# EAGLE design DIYpiano (EAGLE 9.2.2)
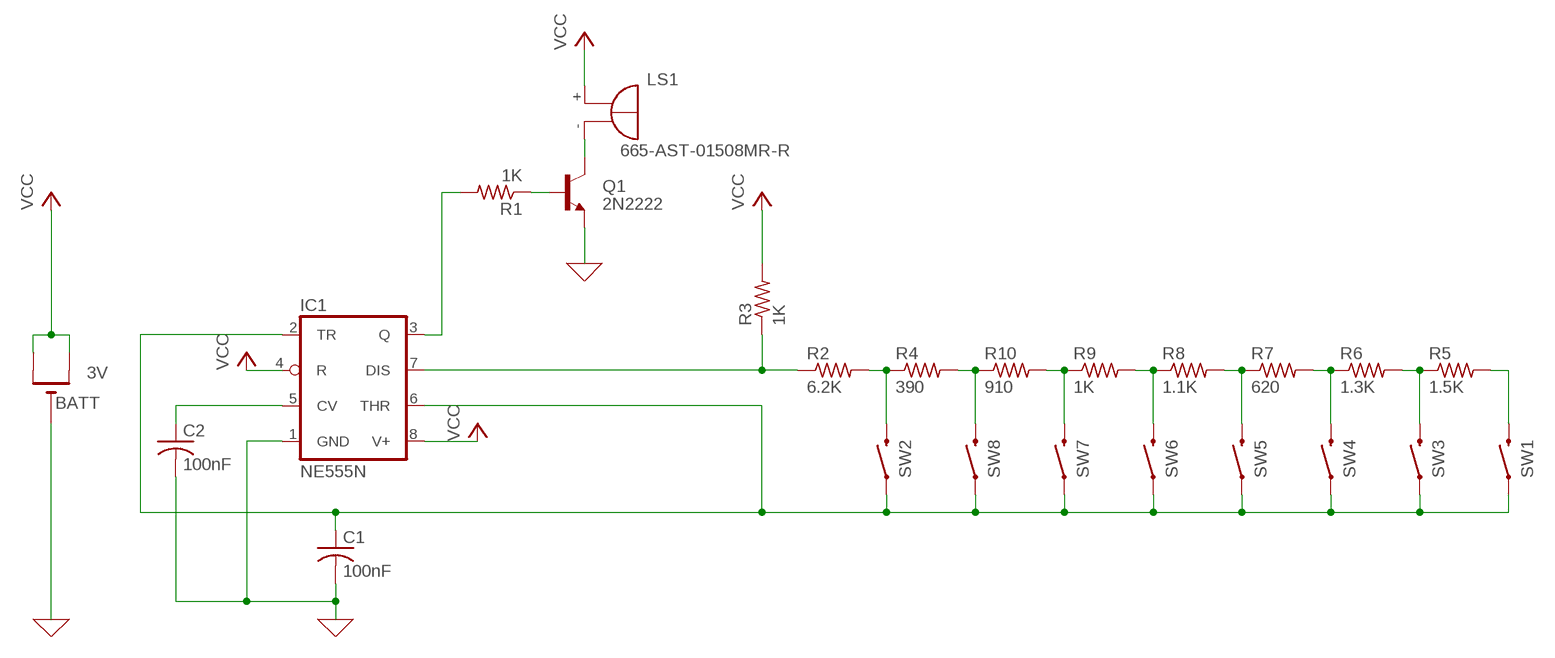
[diagram p0: schematic, sheet 1]

## Parts
BATT  3V  CR1220THM  [CR1220-THM]
C1  100nF  C-US025-025X050  [C025-025X050]
C2  100nF  C-US025-025X050  [C025-025X050]
IC1  NE555N  [DIL08]
LS1  F/HMB  [F/HMB]
Q1  2N2222  -NPN-TO92-E1  [TO92-E1]
R1  1K  R-US_0207/10  [0207/10]
R2  6.2K  R-US_0207/10  [0207/10]
R3  1K  R-US_0207/10  [0207/10]
R4  390  R-US_0207/10  [0207/10]
R5  1.5K  R-US_0207/10  [0207/10]
R6  1.3K  R-US_0207/10  [0207/10]
R7  620  R-US_0207/10  [0207/10]
R8  1.1K  R-US_0207/10  [0207/10]
R9  1K  R-US_0207/10  [0207/10]
R10  910  R-US_0207/10  [0207/10]
SW1  MOMENTARY-SWITCH-SPST-PTH-6.0MM  [TACTILE_SWITCH_PTH_6.0MM]
SW2  MOMENTARY-SWITCH-SPST-PTH-6.0MM  [TACTILE_SWITCH_PTH_6.0MM]
SW3  MOMENTARY-SWITCH-SPST-PTH-6.0MM  [TACTILE_SWITCH_PTH_6.0MM]
SW4  MOMENTARY-SWITCH-SPST-PTH-6.0MM  [TACTILE_SWITCH_PTH_6.0MM]
SW5  MOMENTARY-SWITCH-SPST-PTH-6.0MM  [TACTILE_SWITCH_PTH_6.0MM]
SW6  MOMENTARY-SWITCH-SPST-PTH-6.0MM  [TACTILE_SWITCH_PTH_6.0MM]
SW7  MOMENTARY-SWITCH-SPST-PTH-6.0MM  [TACTILE_SWITCH_PTH_6.0MM]
SW8  MOMENTARY-SWITCH-SPST-PTH-6.0MM  [TACTILE_SWITCH_PTH_6.0MM]

## Nets
GND: BATT.- C1.2 C2.2 IC1.1(GND) Q1.3(E)
N$1: R2.2 R4.1 SW2.3
N$2: IC1.7(DIS) R2.1 R3.1
N$3: C1.1 IC1.2(TR) IC1.6(THR) SW1.1 SW2.1 SW3.1 SW4.1 SW5.1 SW6.1 SW7.1 SW8.1
N$4: R4.2 R10.1 SW8.3
N$5: R9.1 R10.2 SW7.3
N$6: R8.1 R9.2 SW6.3
N$7: R7.1 R8.2 SW5.3
N$8: R6.1 R7.2 SW4.3
N$9: R5.1 R6.2 SW3.3
N$10: R5.2 SW1.3
N$11: IC1.3(Q) R1.2
N$12: C2.1 IC1.5(CV)
N$13: LS1.- Q1.1(C)
N$14: Q1.2(B) R1.1
VCC: BATT.+1(+) BATT.+2(+1) IC1.4(R) IC1.8(V+) LS1.+ R3.2

## Library data of the parts
BATT = adafruit:CR1220: CR1216/CR1220/CR1225 12mm 3V lithium coin cell Great for battery packup. Both SMT and THM holders. Note the THM package has the ground pads on both sides of the PCB so that the masks are the same - this reduces the cost; MF: KEYSTONE ELECTR; MOUSER#: 534-3001; MPN: 3001; OC_NEWARK: 66F5623
C1 C2 = rcl:C-US: CAPACITOR, American symbol; MOUSER#: 581-SR201C104KARTR1; OC_NEWARK: unknown; SPICEPREFIX: C
IC1 = linear:*555: TIMER; MOUSER#: 595-TLC555CP; MPN: TLC555CP; OC_NEWARK: 24M8296
LS1 = buzzer:F/HMB: BUZZER Source: Buerklin; MOUSER#: 665-AST-01508MR-R; OC_FARNELL: unknown; OC_NEWARK: unknown
Q1 = transistor:*-NPN-: NPN Transistror BF959 corrected 2008.03.06; MF: FAIRCHILD SEMICONDUCTOR; MOUSER#: 833-PN2222A-AP; MPN: PN2222ATF; OC_NEWARK: 58K2048
R1 R3 R9 = rcl:R-US_: RESISTOR, American symbol; MOUSER#: 660-MF1/4DCT26A1001F; OC_NEWARK: unknown; SPICEPREFIX: R
R2 = rcl:R-US_: RESISTOR, American symbol; MOUSER#: 603-MFR-25FRF52-6K2; OC_NEWARK: unknown; SPICEPREFIX: R
R4 = rcl:R-US_: RESISTOR, American symbol; MOUSER#: 603-MFR-25FTE52-390R; OC_NEWARK: unknown; SPICEPREFIX: R
R5 = rcl:R-US_: RESISTOR, American symbol; MOUSER#: 603-MFR-25FBF52-1K5; OC_NEWARK: unknown; SPICEPREFIX: R
R6 = rcl:R-US_: RESISTOR, American symbol; MOUSER#: 603-MFR-25FBF52-1K3; OC_NEWARK: unknown; SPICEPREFIX: R
R7 = rcl:R-US_: RESISTOR, American symbol; MOUSER#: 603-MFR-25FBF52-620R; OC_NEWARK: unknown; SPICEPREFIX: R
R8 = rcl:R-US_: RESISTOR, American symbol; MOUSER#: 603-MFR-25FBF52-1K1; OC_NEWARK: unknown; SPICEPREFIX: R
R10 = rcl:R-US_: RESISTOR, American symbol; MOUSER#: 603-MFR-25FRF52-910R; OC_NEWARK: unknown; SPICEPREFIX: R
SW1-SW8 = SparkFun-Switches:MOMENTARY-SWITCH-SPST: Momentary Switch (Pushbutton) - SPST Normally-open (NO) SPST momentary switches (buttons, pushbuttons). Variants PTH-12MM - 12mm square, through-hole Momentary Pushbutton Switch - 12mm Square <https://www.sparkfun.com/products/9190> (COM-09190) PTH-6.0MM, PTH-6.0MM-KIT - 6.0mm square, through-hole Mini Pushbutton Switch <https://www.sparkfun.com/products/97> (COM-00097) KIT package intended for soldering kit's - only one side of pads' copper is exposed. PTH-RIGHT-ANGLE-KIT - Right-angle, through-hole Right Angle Tactile Button <https://www.sparkfun.com/products/10791> - Used on SparkFun BigTime Watch Kit <https://www.sparkfun.com/products/11734> SMD-12MM - 12mm square, surface-mount Tactile Button - SMD (12mm) <https://www.sparkfun.com/products/12993> (COM-12993) Used on SparkFun PicoBoard <https://www.sparkfun.com/products/11888> SMD-4.5MM - 4.5mm Square Trackball Switch Used on SparkFun Blackberry Trackballer Breakout <https://www.sparkfun.com/products/13169> SMD-4.6MMX2.8MM - 4.60mm x 2.80mm, surface mount Used on SparkFun SAMD21 Mini Breakout <https://www.sparkfun.com/products/13664> SMD-5.2MM, SMD-5.2-REDUNDANT - 5.2mm square, surface-mount Mini Pushbutton Switch - SMD <https://www.sparkfun.com/products/8720> (COM-08720) Used on Arduino Pro Mini <https://www.sparkfun.com/products/11114> REDUNDANT package connects both switch circuits together SMD-6.0X3.5MM - 6.0 x 3.5mm, surface mount Momentary Reset Switch SMD <https://www.sparkfun.com/products/8229> (COM-08229) SMD-6.2MM-TALL - 6.2mm square, surface mount Tactile Button - SMD (6mm) <https://www.sparkfun.com/products/12992> Used on SparkFun Digital Sandbox <https://www.sparkfun.com/products/12651> SMD-RIGHT-ANGLE - Right-angle, surface mount Used on SparkFun Block for Intel® Edison - Arduino <https://www.sparkfun.com/products/13036>; MOUSER#: 653-B3F-1000; OC_NEWARK: unknown; PROD_ID: SWCH-08441; SF_SKU: COM-00097

## Net classes
0 default: width 0.305 mm, drill 0.508 mm, clearance 0.254 mm

## Board
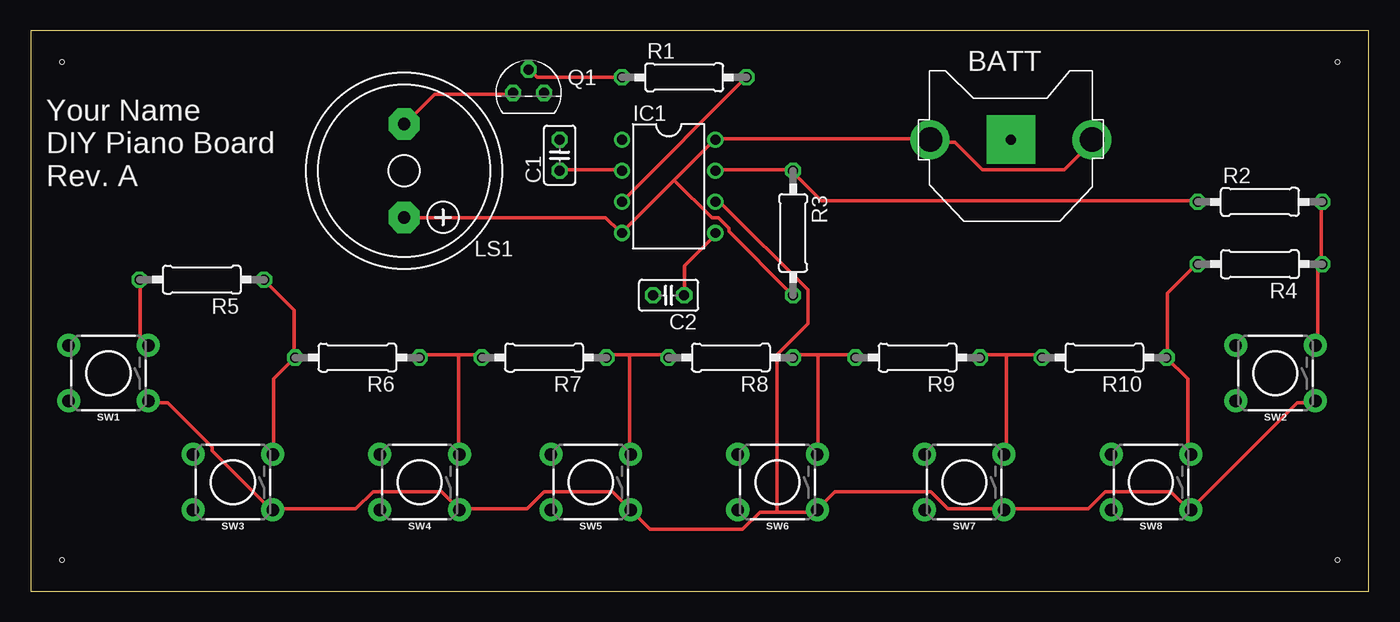
[diagram p1: board, top side]
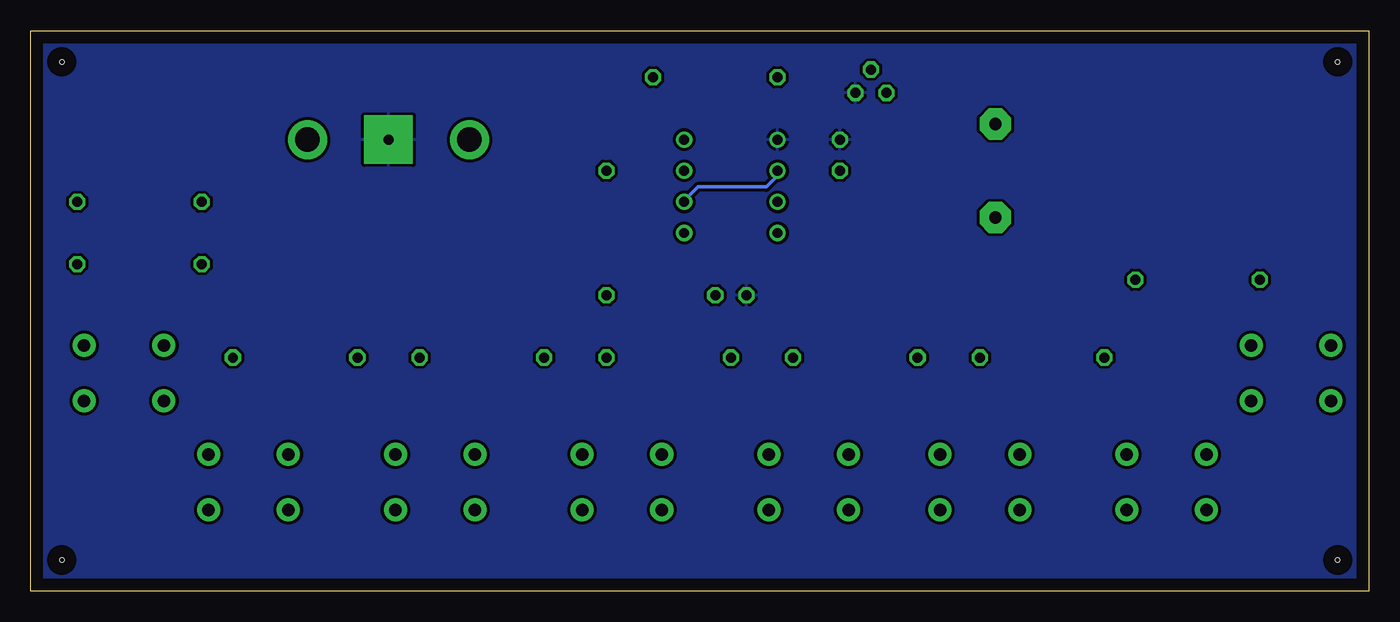
[diagram p2: board, bottom side, seen from below]

Size 109.22 x 45.72 mm. Coordinates in mm from the lower left corner, seen from the top.
Outline: 0,0 109.22,0 109.22,45.72 0,45.72 0,0
Copper layers (1*16): Top 0.035mm / dielectric 1.5mm / Bottom 0.035mm
Design rules "default": minimum track width 6mil, minimum drill 0.35mm, track to track 6mil, track to pad 6mil, pad to pad 6mil, via to via 6mil, smd to smd 6mil, copper to edge 40mil, drill to drill 6mil, minimum pad ring 10mil, minimum via ring 8mil, stop-mask expansion 4mil, vias tented up to drill 0mil, thermal gap 10mil
Holes 0.35 mm at 2.54,43.18 2.54,2.54 106.68,2.54 106.68,43.18

### Footprints (pad centres in the part's own frame; a part is rotated, then mirrored left to right if it is on the bottom)
CR1220-THM = drill 2 pad 3.175: +1 -6.604,0; +2 6.604,0 | drill 0.8 pad 3.962 square: - 0,0
C025-025X050 = drill 0.813 octagon: 1 -1.27,0; 2 1.27,0
DIL08 = drill 0.813 pad 1.27: 1 -3.81,-3.81; 2 -1.27,-3.81; 3 1.27,-3.81; 4 3.81,-3.81; 5 3.81,3.81; 6 1.27,3.81; 7 -1.27,3.81; 8 -3.81,3.81
F/HMB = drill 1.016 pad 2.54 octagon: + 3.81,0; - -3.81,0
TO92-E1 = drill 0.813 octagon: 1 -1.27,0; 2 0,1.905; 3 1.27,0
0207/10 = drill 0.813 octagon: 1 -5.08,0; 2 5.08,0
TACTILE_SWITCH_PTH_6.0MM = drill 1.016 pad 1.88: 1 -3.251,2.261; 2 3.251,2.261; 3 -3.251,-2.261; 4 3.251,-2.261

### Placement (x,y rotation side)
BATT  80.01,36.83 0 top
C1  43.18,35.56 90 top
C2  52.07,24.13 180 top
IC1  52.07,33.02 270 top
LS1  30.48,34.29 270 top
Q1  40.64,40.64 0 top
R1  53.34,41.91 0 top
R2  100.33,31.75 0 top
R3  62.23,29.21 270 top
R4  100.33,26.67 180 top
R5  13.97,25.4 180 top
R6  26.67,19.05 180 top
R7  41.91,19.05 180 top
R8  57.15,19.05 180 top
R9  72.39,19.05 180 top
R10  87.63,19.05 180 top
SW1  6.35,17.78 180 top
SW2  101.6,17.78 180 top
SW3  16.51,8.89 180 top
SW4  31.75,8.89 180 top
SW5  45.72,8.89 180 top
SW6  60.96,8.89 180 top
SW7  76.2,8.89 180 top
SW8  91.44,8.89 180 top

### Tracks (layer width: path | path; a pad name or v marks a point on that pad's centre or on a via)
GND
  pour Bottom: -1.27,46.99 -1.27,-1.27 110.49,-1.27 110.49,46.99
N$1
  Top 0.305: R2.2 105.33,31.57 105.33,26.82 R4.1 105.33,26.54 105.05,26.26 105.05,20.12 SW2.3
N$2
  Top 0.305: IC1.7 55.88,34.37 62.03,34.37 R3.1 62.31,34.09 64.54,31.85 95,31.85 R2.1
N$3
  Top 0.305: SW2.1 104.78,15.37 103.38,15.37 94.72,6.71 SW8.1 94.44,6.71 93.04,8.1 87.73,8.1 86.33,6.71 79.63,6.71 SW7.1 79.35,6.71 74.88,6.71 73.48,8.1 65.66,8.1 64.26,6.71 SW6.1 63.98,6.43 60.91,6.43 | SW1.1 9.78,15.37 11.18,15.37 14.81,11.73 14.81,11.46 19.56,6.71 SW3.1 19.84,6.71 26.54,6.71 27.94,8.1 33.53,8.1 SW4.1 35.2,6.71 40.51,6.71 41.91,8.1 47.5,8.1 SW5.1 50.57,5.03 58.12,5.03 59.51,6.43 60.91,6.43 | C1.1 43.31,34.37 48.06,34.37 IC1.2 | 60.91,6.43 60.91,19.28 63.42,21.79 63.42,24.59 56.44,31.57 55.88,31.57 IC1.6
  Bottom 0.305: IC1.6 55.88,31.85 54.76,32.97 49.17,32.97 48.06,34.09 IC1.2
N$4
  Top 0.305: R4.2 95,26.54 92.76,24.31 92.76,19.28 R10.1 94.44,17.32 94.44,11.18 SW8.3
N$5
  Top 0.305: 79.63,19.28 82.42,19.28 R10.2 | 79.63,19.28 77.67,19.28 R9.1 | 79.63,19.28 79.63,11.18 SW7.3
N$6
  Top 0.305: 64.26,19.28 67.06,19.28 R9.2 | 64.26,19.28 62.31,19.28 R8.1 | 64.26,19.28 64.26,11.18 SW6.3
N$7
  Top 0.305: 48.9,19.28 51.97,19.28 R8.2 | 48.9,19.28 47.22,19.28 R7.1 | 48.9,19.28 48.9,11.18 SW5.3
N$8
  Top 0.305: 34.92,19.28 36.6,19.28 R7.2 | 34.92,19.28 31.85,19.28 R6.1 | 34.92,19.28 34.92,11.18 SW4.3
N$9
  Top 0.305: R5.1 19.28,25.15 21.51,22.91 21.51,19.28 R6.2 21.51,19 19.84,17.32 19.84,11.18 SW3.3
N$10
  Top 0.305: R5.2 8.94,25.15 8.94,20.68 9.5,20.12 SW1.3
N$11
  Top 0.305: IC1.3 48.34,31.85 58.4,41.91 R1.2
N$12
  Top 0.305: C2.1 53.37,24.31 53.37,26.54 55.88,29.06 IC1.5
N$13
  Top 0.305: Q1.1 39.12,40.51 32.97,40.51 30.73,38.28 LS1.-
N$14
  Top 0.305: R1.1 41.35,41.91 40.79,42.47 Q1.2
VCC
  Top 0.305: BATT.+2 86.61,36.6 84.38,34.37 77.67,34.37 75.44,36.6 73.48,36.6 BATT.+1 73.2,36.88 55.88,36.88 | 55.88,36.88 52.53,33.53 | 52.53,33.53 48.34,29.34 IC1.4 48.06,29.34 46.94,30.45 30.73,30.45 LS1.+ | 52.53,33.53 55.6,30.45 56.16,30.45 57,29.62 57,29.34 62.03,24.31 R3.2 | 55.88,36.88 IC1.8

### Text on the board
tPlace: Your Name / DIY Piano Board / Rev. A